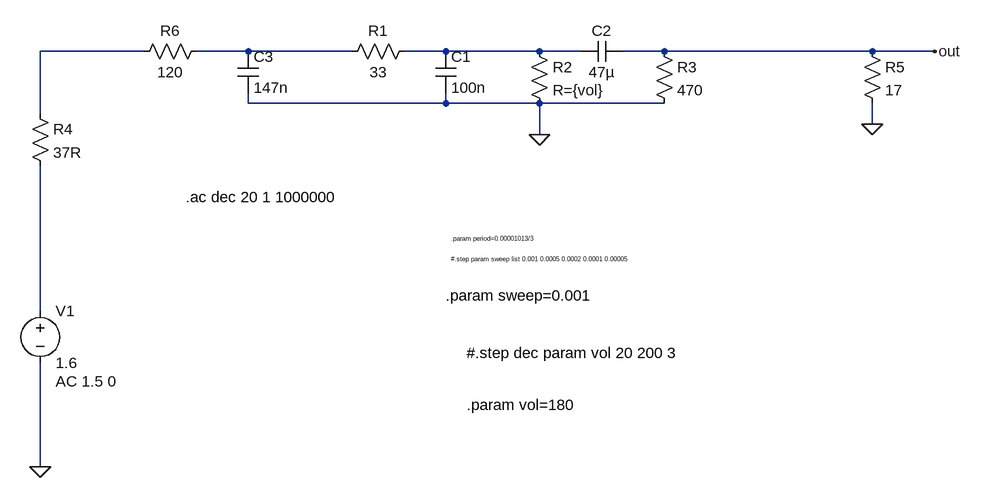
[diagram p0: schematic ACSweep.asc]
ACSweep.asc, the LTspice schematic file:
Version 4
SHEET 1 6680 772
WIRE -384 112 -544 112
WIRE -224 112 -304 112
WIRE -64 112 -224 112
WIRE 80 112 16 112
WIRE 224 112 80 112
WIRE 288 112 224 112
WIRE 416 112 352 112
WIRE 736 112 416 112
WIRE 832 112 736 112
WIRE -224 192 -224 176
WIRE 80 192 80 176
WIRE 80 192 -224 192
WIRE 224 192 80 192
WIRE 416 192 224 192
WIRE -544 208 -544 112
WIRE 736 224 736 192
WIRE 224 240 224 192
WIRE -544 512 -544 288
WIRE -544 752 -544 592
FLAG 832 112 out
FLAG 224 240 0
FLAG 736 224 0
FLAG -544 752 0
SYMBOL res 32 96 R90
WINDOW 0 0 56 VBottom 2
WINDOW 3 32 56 VTop 2
SYMATTR InstName R1
SYMATTR Value 33
SYMBOL res 400 96 R0
SYMATTR InstName R3
SYMATTR Value 470
SYMBOL cap 64 112 R0
SYMATTR InstName C1
SYMATTR Value 100n
SYMBOL cap 288 128 R270
WINDOW 0 32 32 VTop 2
WINDOW 3 0 32 VBottom 2
SYMATTR InstName C2
SYMATTR Value 47µ
SYMBOL res -560 192 R0
SYMATTR InstName R4
SYMATTR Value 37R
SYMBOL res 720 96 R0
SYMATTR InstName R5
SYMATTR Value 17
SYMBOL res -288 96 R90
WINDOW 0 0 56 VBottom 2
WINDOW 3 32 56 VTop 2
SYMATTR InstName R6
SYMATTR Value 120
SYMBOL cap -240 112 R0
SYMATTR InstName C3
SYMATTR Value 147n
SYMBOL res 208 96 R0
SYMATTR InstName R2
SYMATTR Value R={vol}
SYMBOL voltage -544 496 R0
WINDOW 123 24 124 Left 2
WINDOW 39 0 0 Left 0
SYMATTR Value2 AC 1.5 0
SYMATTR InstName V1
SYMATTR Value 1.6
TEXT 88 400 Left 0 !.param period=0.00001013/3
TEXT 88 432 Left 0 !#.step param sweep list 0.001 0.0005 0.0002 0.0001 0.00005
TEXT 80 488 Left 2 !.param sweep=0.001
TEXT -320 336 Left 2 !.ac dec 20 1 1000000
TEXT 112 576 Left 2 !#.step dec param vol 20 200 3
TEXT 112 656 Left 2 !.param vol=180

The netlist it stands for:
* ACSweep.asc
R1 N003 N002 33
R3 out 0 470
C1 N003 0 100n
C2 N003 out 47µ
R4 N001 N004 37R
R5 out 0 17
R6 N002 N001 120
C3 N002 0 147n
R2 N003 0 R={vol}
V1 N004 0 1.6 AC 1.5 0
.param period=0.00001013/3
#.step param sweep list 0.001 0.0005 0.0002 0.0001 0.00005
.param sweep=0.001
.ac dec 20 1 1000000
#.step dec param vol 20 200 3
.param vol=180
.backanno
.end